# EAGLE design a323-vcf (EAGLE 7.6.0)
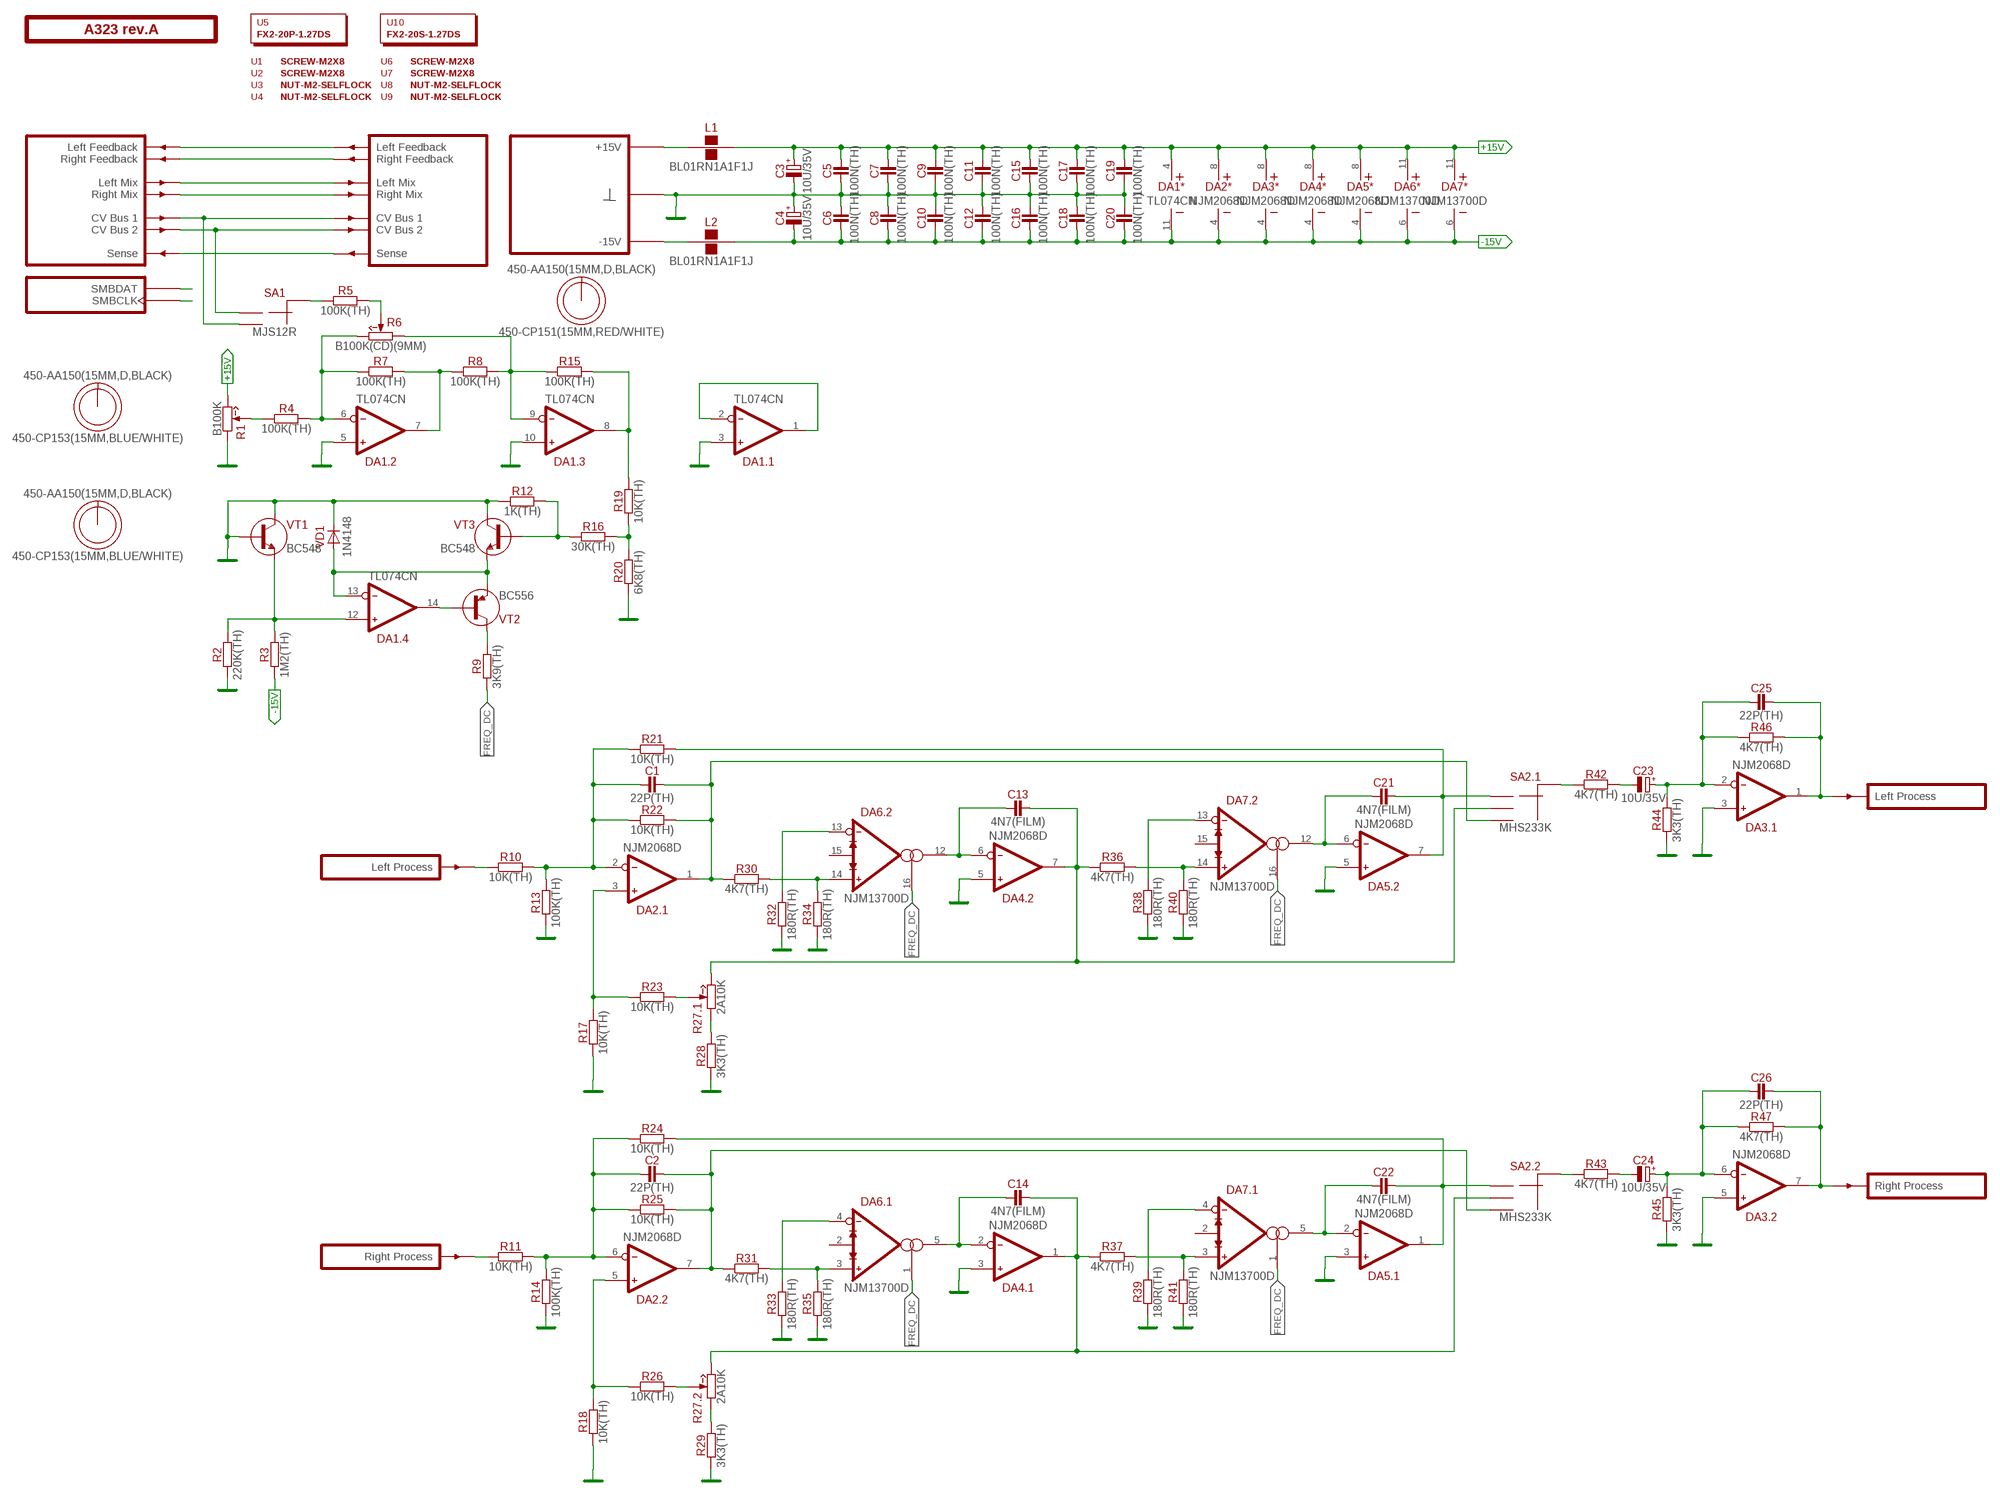
[diagram p0: schematic, sheet 1]

## Parts
C1  22P(TH)  [C050-024X044]
C2  22P(TH)  [C050-024X044]
C3  10U/35V  [E2-5]
C4  10U/35V  [E2-5]
C5  100N(TH)  [C050-024X044]
C6  100N(TH)  [C050-024X044]
C7  100N(TH)  [C050-024X044]
C8  100N(TH)  [C050-024X044]
C9  100N(TH)  [C050-024X044]
C10  100N(TH)  [C050-024X044]
C11  100N(TH)  [C050-024X044]
C12  100N(TH)  [C050-024X044]
C13  4N7(FILM)  [C050-025X075]
C14  4N7(FILM)  [C050-025X075]
C15  100N(TH)  [C050-024X044]
C16  100N(TH)  [C050-024X044]
C17  100N(TH)  [C050-024X044]
C18  100N(TH)  [C050-024X044]
C19  100N(TH)  [C050-024X044]
C20  100N(TH)  [C050-024X044]
C21  4N7(FILM)  [C050-025X075]
C22  4N7(FILM)  [C050-025X075]
C23  10U/35V  [E2-5]
C24  10U/35V  [E2-5]
C25  22P(TH)  [C050-024X044]
C26  22P(TH)  [C050-024X044]
DA1  TL074CN  [DIP-14]
DA2  NJM2068D  [DIP-8]
DA3  NJM2068D  [DIP-8]
DA4  NJM2068D  [DIP-8]
DA5  NJM2068D  [DIP-8]
DA6  NJM13700D  [DIP-16]
DA7  NJM13700D  [DIP-16]
L1  BL01RN1A1F1J  [BL01RN1A]
L2  BL01RN1A1F1J  [BL01RN1A]
O1  450-AA150(15MM,D,BLACK)  [EMPTY]
O2  450-CP153(15MM,BLUE/WHITE)  [EMPTY]
O3  450-AA150(15MM,D,BLACK)  [EMPTY]
O4  450-CP153(15MM,BLUE/WHITE)  [EMPTY]
O5  450-AA150(15MM,D,BLACK)  [EMPTY]
O6  450-CP151(15MM,RED/WHITE)  [EMPTY]
PCB1  A323 rev.A  ST2-BOARD-74  [ST2-BOARD-74]
R1  B100K  [RV11-SINGLE]
R2  220K(TH)  [R-0207/10]
R3  1M2(TH)  [R-0207/10]
R4  100K(TH)  [R-0207/10]
R5  100K(TH)  [R-0207/10]
R6  B100K(CD)(9MM)  [RV09-SINGLE]
R7  100K(TH)  [R-0207/10]
R8  100K(TH)  [R-0207/10]
R9  3K9(TH)  [R-0207/10]
R10  10K(TH)  [R-0207/10]
R11  10K(TH)  [R-0207/10]
R12  1K(TH)  [R-0207/10]
R13  100K(TH)  [R-0207/10]
R14  100K(TH)  [R-0207/10]
R15  100K(TH)  [R-0207/10]
R16  30K(TH)  [R-0207/10]
R17  10K(TH)  [R-0207/10]
R18  10K(TH)  [R-0207/10]
R19  10K(TH)  [R-0207/10]
R20  6K8(TH)  [R-0207/10]
R21  10K(TH)  [R-0207/10]
R22  10K(TH)  [R-0207/10]
R23  10K(TH)  [R-0207/10]
R24  10K(TH)  [R-0207/10]
R25  10K(TH)  [R-0207/10]
R26  10K(TH)  [R-0207/10]
R27  2A10K  [RV11-DUAL]
R28  3K3(TH)  [R-0207/10]
R29  3K3(TH)  [R-0207/10]
R30  4K7(TH)  [R-0207/10]
R31  4K7(TH)  [R-0207/10]
R32  180R(TH)  [R-0207/10]
R33  180R(TH)  [R-0207/10]
R34  180R(TH)  [R-0207/10]
R35  180R(TH)  [R-0207/10]
R36  4K7(TH)  [R-0207/10]
R37  4K7(TH)  [R-0207/10]
R38  180R(TH)  [R-0207/10]
R39  180R(TH)  [R-0207/10]
R40  180R(TH)  [R-0207/10]
R41  180R(TH)  [R-0207/10]
R42  4K7(TH)  [R-0207/10]
R43  4K7(TH)  [R-0207/10]
R44  3K3(TH)  [R-0207/10]
R45  3K3(TH)  [R-0207/10]
R46  4K7(TH)  [R-0207/10]
R47  4K7(TH)  [R-0207/10]
SA1  MJS12R  [APEM-MJS12R]
SA2  MHS233K  [APEM-MHS233K]
U1  SCREW-M2X8  [EMPTY]
U2  SCREW-M2X8  [EMPTY]
U3  NUT-M2-SELFLOCK  [EMPTY]
U4  NUT-M2-SELFLOCK  [EMPTY]
U5  FX2-20P-1.27DS  [EMPTY]
U6  SCREW-M2X8  [EMPTY]
U7  SCREW-M2X8  [EMPTY]
U8  NUT-M2-SELFLOCK  [EMPTY]
U9  NUT-M2-SELFLOCK  [EMPTY]
U10  FX2-20S-1.27DS  [EMPTY]
VD1  1N4148  [DO35-7]
VT1  BC548  [TO92]
VT2  BC556  [TO92]
VT3  BC548  [TO92]

## Nets
+15V: C3.+ C5.2 C7.2 C9.2 C11.2 C15.2 C17.2 C19.2 DA1.4(*:V+) DA2.8(*:V+) DA3.8(*:V+) DA4.8(*:V+) DA5.8(*:V+) DA6.11(*:V+) DA7.11(*:V+) L1.2 R1.3(CW)
-15V: C4.- C6.1 C8.1 C10.1 C12.1 C16.1 C18.1 C20.1 DA1.11(*:V-) DA2.4(*:V-) DA3.4(*:V-) DA4.4(*:V-) DA5.4(*:V-) DA6.6(*:V-) DA7.6(*:V-) L2.2 R3.1
FREQ_DC: DA6.1(.1:AMP_BIAS) DA6.16(.2:AMP_BIAS) DA7.1(.1:AMP_BIAS) DA7.16(.2:AMP_BIAS) R9.1
GND: C3.- C4.+ C5.1 C6.2 C7.1 C8.2 C9.1 C10.2 C11.1 C12.2 C15.1 C16.2 C17.1 C18.2 C19.1 C20.2 DA1.3(.1:IN+) DA1.5(.2:IN+) DA1.10(.3:IN+) DA3.3(.1:IN+) DA3.5(.2:IN+) DA4.3(.1:IN+) DA4.5(.2:IN+) DA5.3(.1:IN+) DA5.5(.2:IN+) PCB1.B4'(GND) PCB1.B4(GND) PCB1.B5'(GND) PCB1.B5(GND) PCB1.B6'(GND) PCB1.B6(GND) PCB1.B7'(GND) PCB1.B7(GND) PCB1.B8'(GND) PCB1.B8(GND) R1.1(CCW) R2.1 R12.1 R13.1 R14.1 R17.1 R18.1 R20.1 R28.1 R29.1 R32.1 R33.1 R34.1 R35.1 R38.1 R39.1 R40.1 R41.1 R44.1 R45.1 VD1.C VT1.1(C) VT1.2(B) VT3.1(C)
LMIX: PCB1.ALMIX'(LMIX') PCB1.ALMIX(LMIX)
N$1: L1.1 PCB1.A+15'(P+15V) PCB1.A+15(P+15V) PCB1.B+15'(P+15V) PCB1.B+15(P+15V)
N$2: PCB1.ALFBK'(LFBK') PCB1.ALFBK(LFBK)
N$3: R5.2 R6.2(W)
N$4: PCB1.ARFBK'(RFBK') PCB1.ARFBK(RFBK)
N$5: DA1.6(.2:IN-) R4.2 R6.3(CW) R7.1
N$6: DA1.7(.2:OUT) R7.2 R8.1
N$7: DA1.9(.3:IN-) R6.1(CCW) R8.2 R15.1
N$8: R16.2 R19.1 R20.2
N$9: R5.1 SA1.C(CM)
N$10: R12.2 R16.1 VT3.2(B)
N$11: R42.1 SA2.CMN(.1:CM)
N$12: C1.1 DA2.2(.1:IN-) R10.2 R13.2 R21.1 R22.1
N$13: R1.2(W) R4.1
N$14: DA1.13(.4:IN-) VD1.A VT2.3(E) VT3.3(E)
N$15: PCB1.ACV1'(CV1') PCB1.ACV1(CV1) SA1.NO
N$16: PCB1.BSENSE'(SENSE') PCB1.BSENSE(SENSE)
N$17: DA1.14(.4:OUT) VT2.2(B)
N$18: R9.2 VT2.1(C)
N$19: DA1.12(.4:IN+) R2.2 R3.2 VT1.3(E)
N$20: DA2.3(.1:IN+) R17.2 R23.1
N$21: R23.2 R27.2(.1:W)
N$22: R27.1(.1:CCW) R28.2
N$23: C1.2 DA2.1(.1:OUT) R22.2 R30.1 SA2.3
N$24: DA6.14(.2:IN+) R30.2 R34.2
N$25: L2.1 PCB1.A-15'(P-15V) PCB1.A-15(P-15V) PCB1.B-15'(P-15V) PCB1.B-15(P-15V)
N$26: DA6.13(.2:IN-) R32.2
N$27: C13.1 DA4.6(.2:IN-) DA6.12(.2:OUT)
N$28: DA1.8(.3:OUT) R15.2 R19.2
N$29: C13.2 DA4.7(.2:OUT) R27.3(.1:CW) R36.1 SA2.2
N$30: DA7.14(.2:IN+) R36.2 R40.2
N$31: DA7.13(.2:IN-) R38.2
N$32: C23.- R42.2
N$33: C21.1 DA5.6(.2:IN-) DA7.12(.2:OUT)
N$34: C21.2 DA5.7(.2:OUT) R21.2 SA2.1
N$35: C23.+ C25.1 DA3.2(.1:IN-) R44.2 R46.1
N$36: C25.2 DA3.1(.1:OUT) PCB1.BOUTL'(OUTL) R46.2
N$37: C2.1 DA2.6(.2:IN-) R11.2 R14.2 R24.1 R25.1
N$38: PCB1.ASMBDAT'(SMBDAT) PCB1.ASMBDAT(SMBDAT)
N$39: DA2.5(.2:IN+) R18.2 R26.1
N$40: R26.2 R27.2'(.2:W)
N$41: R27.1'(.2:CCW) R29.2
N$42: PCB1.ACV2'(CV2') PCB1.ACV2(CV2) SA1.NC
N$43: PCB1.ASMBCLK'(SMBCLK) PCB1.ASMBCLK(SMBCLK)
N$44: C2.2 DA2.7(.2:OUT) R25.2 R31.1 SA2.3'
N$45: DA6.3(.1:IN+) R31.2 R35.2
N$46: DA6.4(.1:IN-) R33.2
N$47: C14.1 DA4.2(.1:IN-) DA6.5(.1:OUT)
N$48: C14.2 DA4.1(.1:OUT) R27.3'(.2:CW) R37.1 SA2.2'
N$49: DA7.3(.1:IN+) R37.2 R41.2
N$50: DA7.4(.1:IN-) R39.2
N$51: C22.1 DA5.2(.1:IN-) DA7.5(.1:OUT)
N$52: C22.2 DA5.1(.1:OUT) R24.2 SA2.1'
N$53: R43.1 SA2.CMN'(.2:CM)
N$54: C24.- R43.2
N$55: C24.+ C26.1 DA3.6(.2:IN-) R45.2 R47.1
N$56: C26.2 DA3.7(.2:OUT) PCB1.BOUTR'(OUTR) R47.2
N$57: PCB1.BINL(INL) R10.1
N$58: PCB1.BINR(INR) R11.1
N$59: DA1.1(.1:OUT) DA1.2(.1:IN-)
RMIX: PCB1.ARMIX'(RMIX') PCB1.ARMIX(RMIX)
Unconnected: DA6.2(.1:DIODE_BIAS) DA6.7(.3:B) DA6.8(.3:E) DA6.9(.4:E) DA6.10(.4:B) DA6.15(.2:DIODE_BIAS) DA7.2(.1:DIODE_BIAS) DA7.7(.3:B) DA7.8(.3:E) DA7.9(.4:E) DA7.10(.4:B) DA7.15(.2:DIODE_BIAS)

## Library data of the parts
C1 C2 C13 C14 C21 C22 C25 C26 = capacitors:?
C3 C4 C23 C24 = capacitors-electrolytic:?; MOUSER: 647-USW1V100MDD
C5-C12 C15-C20 = capacitors:?; MOUSER: 81-RCER71H104K0A2H3B
DA1 = ic-ti:TL074
DA2-DA5 = ic-jrc:NJM2068; MOUSER: 513-NJM2068D
DA6 DA7 = ic-jrc:NJM13700
L1 L2 = inductors:BL01RN1A?; MOUSER: 81-BL01RN1A1F1J
O1 O3 O5 = hardware:450-AA?; MOUSER: 450-AA150
O2 O4 = hardware:450-C?; MOUSER: 450-CP153
O6 = hardware:450-C?
PCB1 = module-footprints:ST2-BOARD-?
R1 = potentiometers:?
R2 R3 R9 R16 R20 R28-R47 = resistors:?
R4 R5 R7 R8 R13-R15 = resistors:?; MOUSER: 71-RN55D-F-100K
R6 = potentiometers:?; MOUSER: 652-PTV09A-4225FB104
R10 R11 R17-R19 R21-R26 = resistors:?; MOUSER: 71-RN55D-F-10K
R12 = resistors:?; MOUSER: 71-RN55D-F-1.0K
R27 = potentiometers:2**?; MOUSER: 688-RK12L12C0A0E
SA1 = switches:MJS12R; MOUSER: 642-MJS12R
SA2 = switches:MHS233K
U1-U4 U6-U9 = hardware:*?
U5 = hardware:?; MOUSER: 798-FX2-20P-1.27DS71
U10 = hardware:?; MOUSER: 798-FX2-20S-1.27DS71
VD1 = diodes:?; MOUSER: 583-1N4148-T
VT1 VT3 = transistors-npn:?
VT2 = transistors-pnp:?

## Board
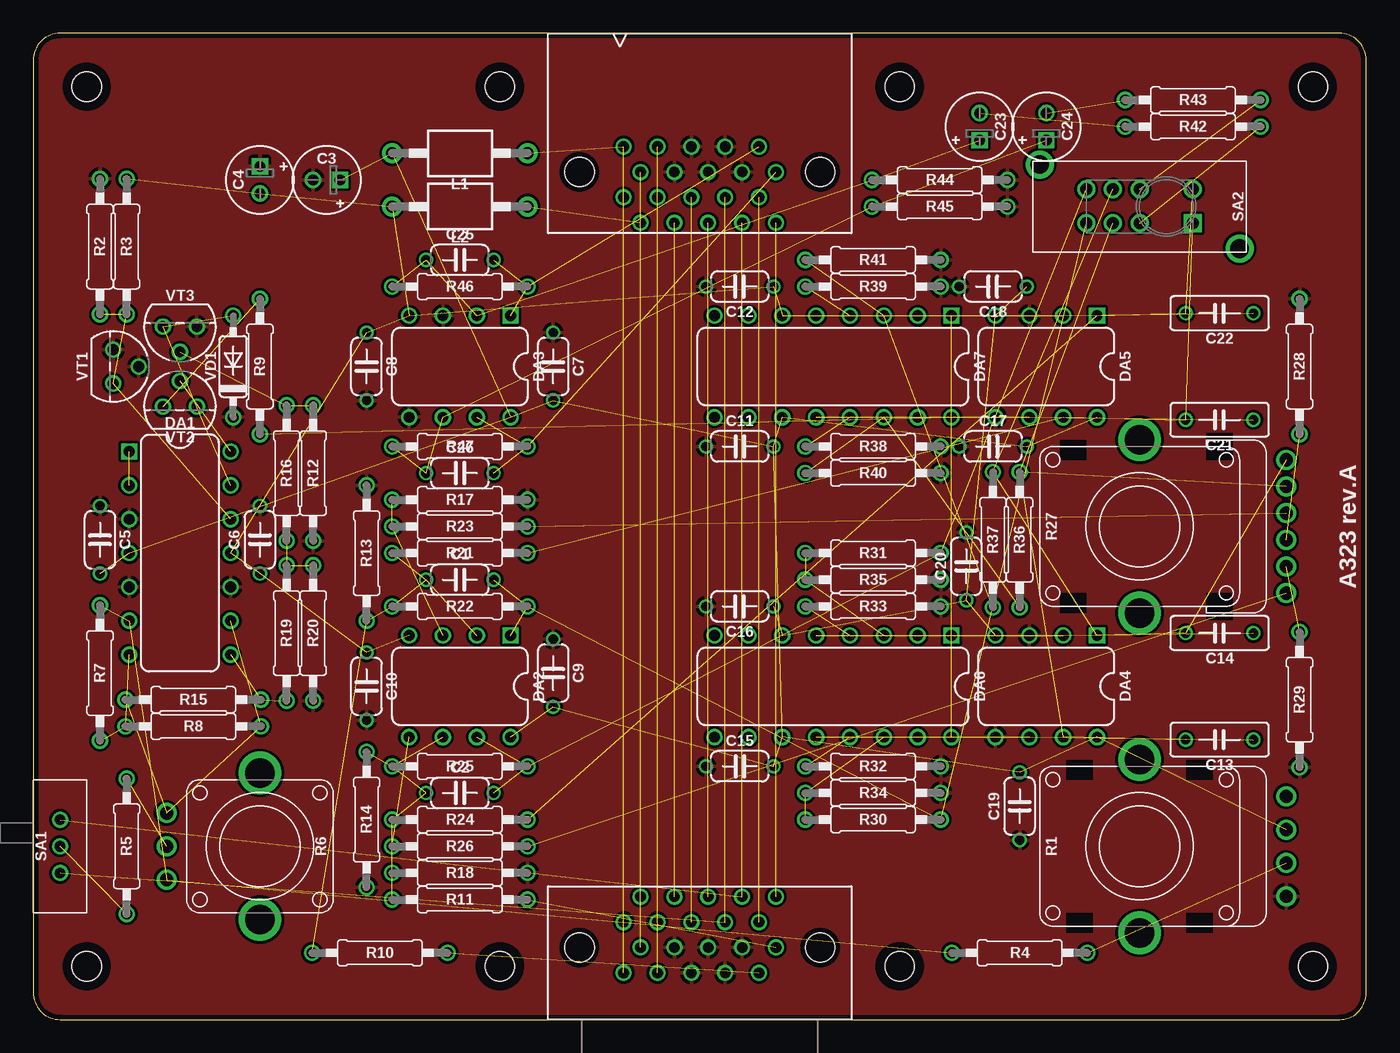
[diagram p1: board, top side]
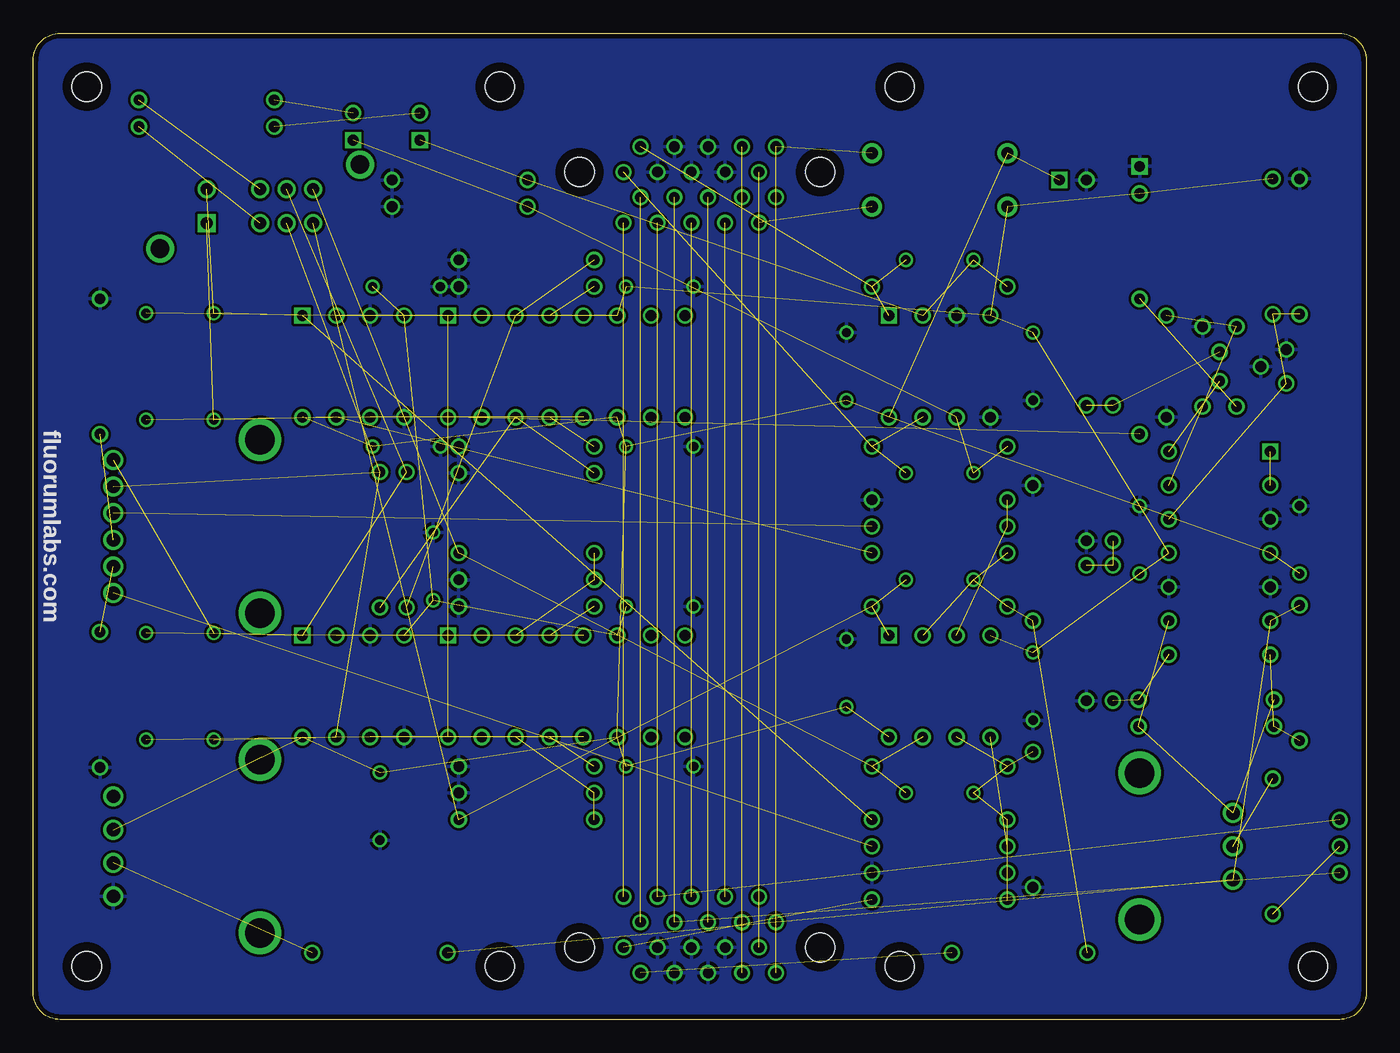
[diagram p2: board, bottom side, seen from below]

Size 100 x 74 mm. Coordinates in mm from the lower left corner, seen from the top.
Outline: 0,72 0,2 arc90 2,0 98,0 arc90 100,2 100,72 arc90 98,74 2,74 arc90 0,72
Copper layers (1*16): Top 0.0356mm / dielectric 1.5011mm / Bottom 0.0356mm
Design rules "sonictrain": minimum track width 6mil, minimum drill 13mil, track to track 8mil, track to pad 8mil, pad to pad 6mil, via to via 6mil, smd to smd 6mil, copper to edge 15mil, drill to drill 6mil, minimum pad ring 7mil, minimum via ring 7mil, stop-mask expansion 3mil, vias tented up to drill 25mil, thermal gap 10mil

### Footprints (pad centres in the part's own frame; a part is rotated, then mirrored left to right if it is on the bottom)
C050-024X044 = drill 0.7: 1 -2.54,0; 2 2.54,0
E2-5 = drill 0.813 square: + -1.016,0 | drill 0.813: - 1.016,0
C050-025X075 = drill 0.7: 1 -2.54,0; 2 2.54,0
DIP-14 = drill 0.813 square: 1 -7.62,-3.81 | drill 0.813: 2 -5.08,-3.81; 3 -2.54,-3.81; 4 0,-3.81; 5 2.54,-3.81; 6 5.08,-3.81; 7 7.62,-3.81; 8 7.62,3.81; 9 5.08,3.81; 10 2.54,3.81; 11 0,3.81; 12 -2.54,3.81; 13 -5.08,3.81; 14 -7.62,3.81
DIP-8 = drill 0.813 square: 1 -3.81,-3.81 | drill 0.813: 2 -1.27,-3.81; 3 1.27,-3.81; 4 3.81,-3.81; 5 3.81,3.81; 6 1.27,3.81; 7 -1.27,3.81; 8 -3.81,3.81
DIP-16 = drill 0.813 square: 1 -8.89,-3.81 | drill 0.813: 2 -6.35,-3.81; 3 -3.81,-3.81; 4 -1.27,-3.81; 5 1.27,-3.81; 6 3.81,-3.81; 7 6.35,-3.81; 8 8.89,-3.81; 9 8.89,3.81; 10 6.35,3.81; 11 3.81,3.81; 12 1.27,3.81; 13 -1.27,3.81; 14 -3.81,3.81; 15 -6.35,3.81; 16 -8.89,3.81
BL01RN1A = drill 0.9 pad 1.5: 1 -5.08,0; 2 5.08,0
ST2-BOARD-74 = drill 0.8: A+15 44.285,7.31; A+15' 44.285,61.69; A-15 45.555,9.215; A-15' 45.555,59.785; ACV1 51.905,7.31; ACV1' 51.905,61.69; ACV2 53.175,9.215; ACV2' 53.175,59.785; ALFBK 49.365,7.31; ALFBK' 49.365,61.69; ALMIX 46.825,7.31; ALMIX' 46.825,61.69; ARFBK 50.635,9.215; ARFBK' 50.635,59.785; ARMIX 48.095,9.215; ARMIX' 48.095,59.785; ASMBCLK 55.715,9.215; ASMBCLK' 55.715,59.785; ASMBDAT 54.445,7.31; ASMBDAT' 54.445,61.69; B4 48.095,5.405; B4' 48.095,63.595; B5 49.365,3.5; B5' 49.365,65.5; B6 50.635,5.405; B6' 50.635,63.595; B7 51.905,3.5; B7' 51.905,65.5; B8 53.175,5.405; B8' 53.175,63.595; B+15 44.285,3.5; B+15' 44.285,65.5; B-15 45.555,5.405; B-15' 45.555,63.595; BINL 54.445,3.5; BINR 55.715,5.405; BOUTL' 54.445,65.5; BOUTR' 55.715,63.595; BSENSE 46.825,3.5; BSENSE' 46.825,65.5 | hole 2.2: 4,4; 4,70; 96,4; 96,70; 35,70; 65,70; 65,4; 35,4; 59.025,5.405; 40.975,5.405; 40.975,63.595; 59.025,63.595
RV11-SINGLE = drill 1: 1 -3.75,-11; 2 -1.25,-11; 3 1.25,-11; 4 3.75,-11 | drill 2.2: S1 -6.5,0; S2 6.5,0
R-0207/10 = drill 0.813: 1 -5.08,0; 2 5.08,0
RV09-SINGLE = drill 1: 1 -2.5,-7; 2 0,-7; 3 2.5,-7 | drill 2.2: S1 -5.5,0; S2 5.5,0
RV11-DUAL = drill 1: 1 -1,-11; 1' -3,-11; 2 1,-11; 2' -5,-11; 3 3,-11; 3' 5,-11 | drill 2.2: S1 -6.5,0; S2 6.5,0
APEM-MJS12R = drill 0.8: C 0,-2; NC 2,-2; NO -2,-2
APEM-MHS233K = drill 0.9 square: 1 -4,1.25 | drill 0.9: 1' -4,-1.29; 2 2,1.25; 2' 2,-1.29; 3 4,1.25; 3' 4,-1.29; CMN 0,1.25; CMN' 0,-1.29 | drill 1.4: S1 -7.5,3.15; S2 7.5,-3.15
DO35-7 = drill 0.813: A 3.81,0; C -3.81,0
TO92 = drill 0.813: 1 -1.27,0; 2 0,1.905; 3 1.27,0

### Placement (x,y rotation side)
C1  32,33 0 top
C2  32,17 0 top
C3  22,63 180 top
C4  17,63 270 top
C5  5,36 270 top
C6  17,36 90 top
C7  39,49 270 top
C8  25,49 270 top
C9  39,26 270 top
C10  25,25 270 top
C11  53,43 0 top
C12  53,55 180 top
C13  89,21 180 top
C14  89,29 180 top
C15  53,19 0 top
C16  53,31 180 top
C17  72,43 0 top
C18  72,55 180 top
C19  74,16 90 top
C20  70,34 90 top
C21  89,45 180 top
C22  89,53 180 top
C23  71,67 90 top
C24  76,67 90 top
C25  32,57 0 top
C26  32,41 0 top
DA1  11,35 270 top
DA2  32,25 180 top
DA3  32,49 180 top
DA4  76,25 180 top
DA5  76,49 180 top
DA6  60,25 180 top
DA7  60,49 180 top
L1  32,65 180 top
L2  32,61 180 top
O1  118,-141 0 top  (outside the outline)
O2  121,-141 0 top  (outside the outline)
O3  1,-144 0 top  (outside the outline)
O4  4,-144 0 top  (outside the outline)
O5  7,-144 0 top  (outside the outline)
O6  10,-144 0 top  (outside the outline)
PCB1  0,0 0 top
R1  83,13 90 top
R2  5,58 270 top
R3  7,58 270 top
R4  74,5 180 top
R5  7,13 90 top
R6  17,13 270 top
R7  5,26 270 top
R8  12,22 0 top
R9  17,49 90 top
R10  26,5 180 top
R11  32,9 180 top
R12  21,41 90 top
R13  25,35 270 top
R14  25,15 90 top
R15  12,24 0 top
R16  19,41 270 top
R17  32,39 180 top
R18  32,11 180 top
R19  19,29 270 top
R20  21,29 90 top
R21  32,35 0 top
R22  32,31 0 top
R23  32,37 0 top
R24  32,15 0 top
R25  32,19 0 top
R26  32,13 0 top
R27  2*A10K  [RV11-DUAL]  83,37 90 top
R28  95,49 270 top
R29  95,24 90 top
R30  63,15 180 top
R31  63,35 180 top
R32  63,19 180 top
R33  63,31 180 top
R34  63,17 180 top
R35  63,33 180 top
R36  74,36 270 top
R37  72,36 270 top
R38  63,43 180 top
R39  63,55 180 top
R40  63,41 180 top
R41  63,57 180 top
R42  87,67 180 top
R43  87,69 180 top
R44  68,63 180 top
R45  68,61 180 top
R46  32,55 0 top
R47  32,43 0 top
SA1  0,13 90 top
SA2  83,61 180 top
U1  13,-144 0 top  (outside the outline)
U2  16,-144 0 top  (outside the outline)
U3  19,-144 0 top  (outside the outline)
U4  22,-144 0 top  (outside the outline)
U5  25,-144 0 top  (outside the outline)
U6  28,-144 0 top  (outside the outline)
U7  31,-144 0 top  (outside the outline)
U8  34,-144 0 top  (outside the outline)
U9  37,-144 0 top  (outside the outline)
U10  40,-144 0 top  (outside the outline)
VD1  15,49 90 top
VT1  6,49 270 top
VT2  11,46 0 top
VT3  11,52 180 top

### Tracks (layer width: path | path; a pad name or v marks a point on that pad's centre or on a via)
+15V  (16 unrouted)
-15V  (16 unrouted)
FREQ_DC  (4 unrouted)
GND
  pour Top: 0,74 100,74 100,0 0,0
  pour Bottom: 0,74 100,74 100,0 0,0
LMIX  (1 unrouted)
N$1  (4 unrouted)
N$2  (1 unrouted)
N$3  (1 unrouted)
N$4  (1 unrouted)
N$5  (3 unrouted)
N$6  (2 unrouted)
N$7  (3 unrouted)
N$8  (2 unrouted)
N$9  (1 unrouted)
N$10  (2 unrouted)
N$11  (1 unrouted)
N$12  (5 unrouted)
N$13  (1 unrouted)
N$14  (3 unrouted)
N$15  (2 unrouted)
N$16  (1 unrouted)
N$17  (1 unrouted)
N$18  (1 unrouted)
N$19  (3 unrouted)
N$20  (2 unrouted)
N$21  (1 unrouted)
N$22  (1 unrouted)
N$23  (4 unrouted)
N$24  (2 unrouted)
N$25  (4 unrouted)
N$26  (1 unrouted)
N$27  (2 unrouted)
N$28  (2 unrouted)
N$29  (4 unrouted)
N$30  (2 unrouted)
N$31  (1 unrouted)
N$32  (1 unrouted)
N$33  (2 unrouted)
N$34  (3 unrouted)
N$35  (4 unrouted)
N$36  (3 unrouted)
N$37  (5 unrouted)
N$38  (1 unrouted)
N$39  (2 unrouted)
N$40  (1 unrouted)
N$41  (1 unrouted)
N$42  (2 unrouted)
N$43  (1 unrouted)
N$44  (4 unrouted)
N$45  (2 unrouted)
N$46  (1 unrouted)
N$47  (2 unrouted)
N$48  (4 unrouted)
N$49  (2 unrouted)
N$50  (1 unrouted)
N$51  (2 unrouted)
N$52  (3 unrouted)
N$53  (1 unrouted)
N$54  (1 unrouted)
N$55  (4 unrouted)
N$56  (3 unrouted)
N$57  (1 unrouted)
N$58  (1 unrouted)
N$59  (1 unrouted)
RMIX  (1 unrouted)